# EasyEDA schematic madiz_plate_sheet_v3_2.json
TITLE: Sheet_1; REV: 1.0; Date: 2023-11-21; Sheet: 1/1; Drawn By: 56tree; Company: Your Company
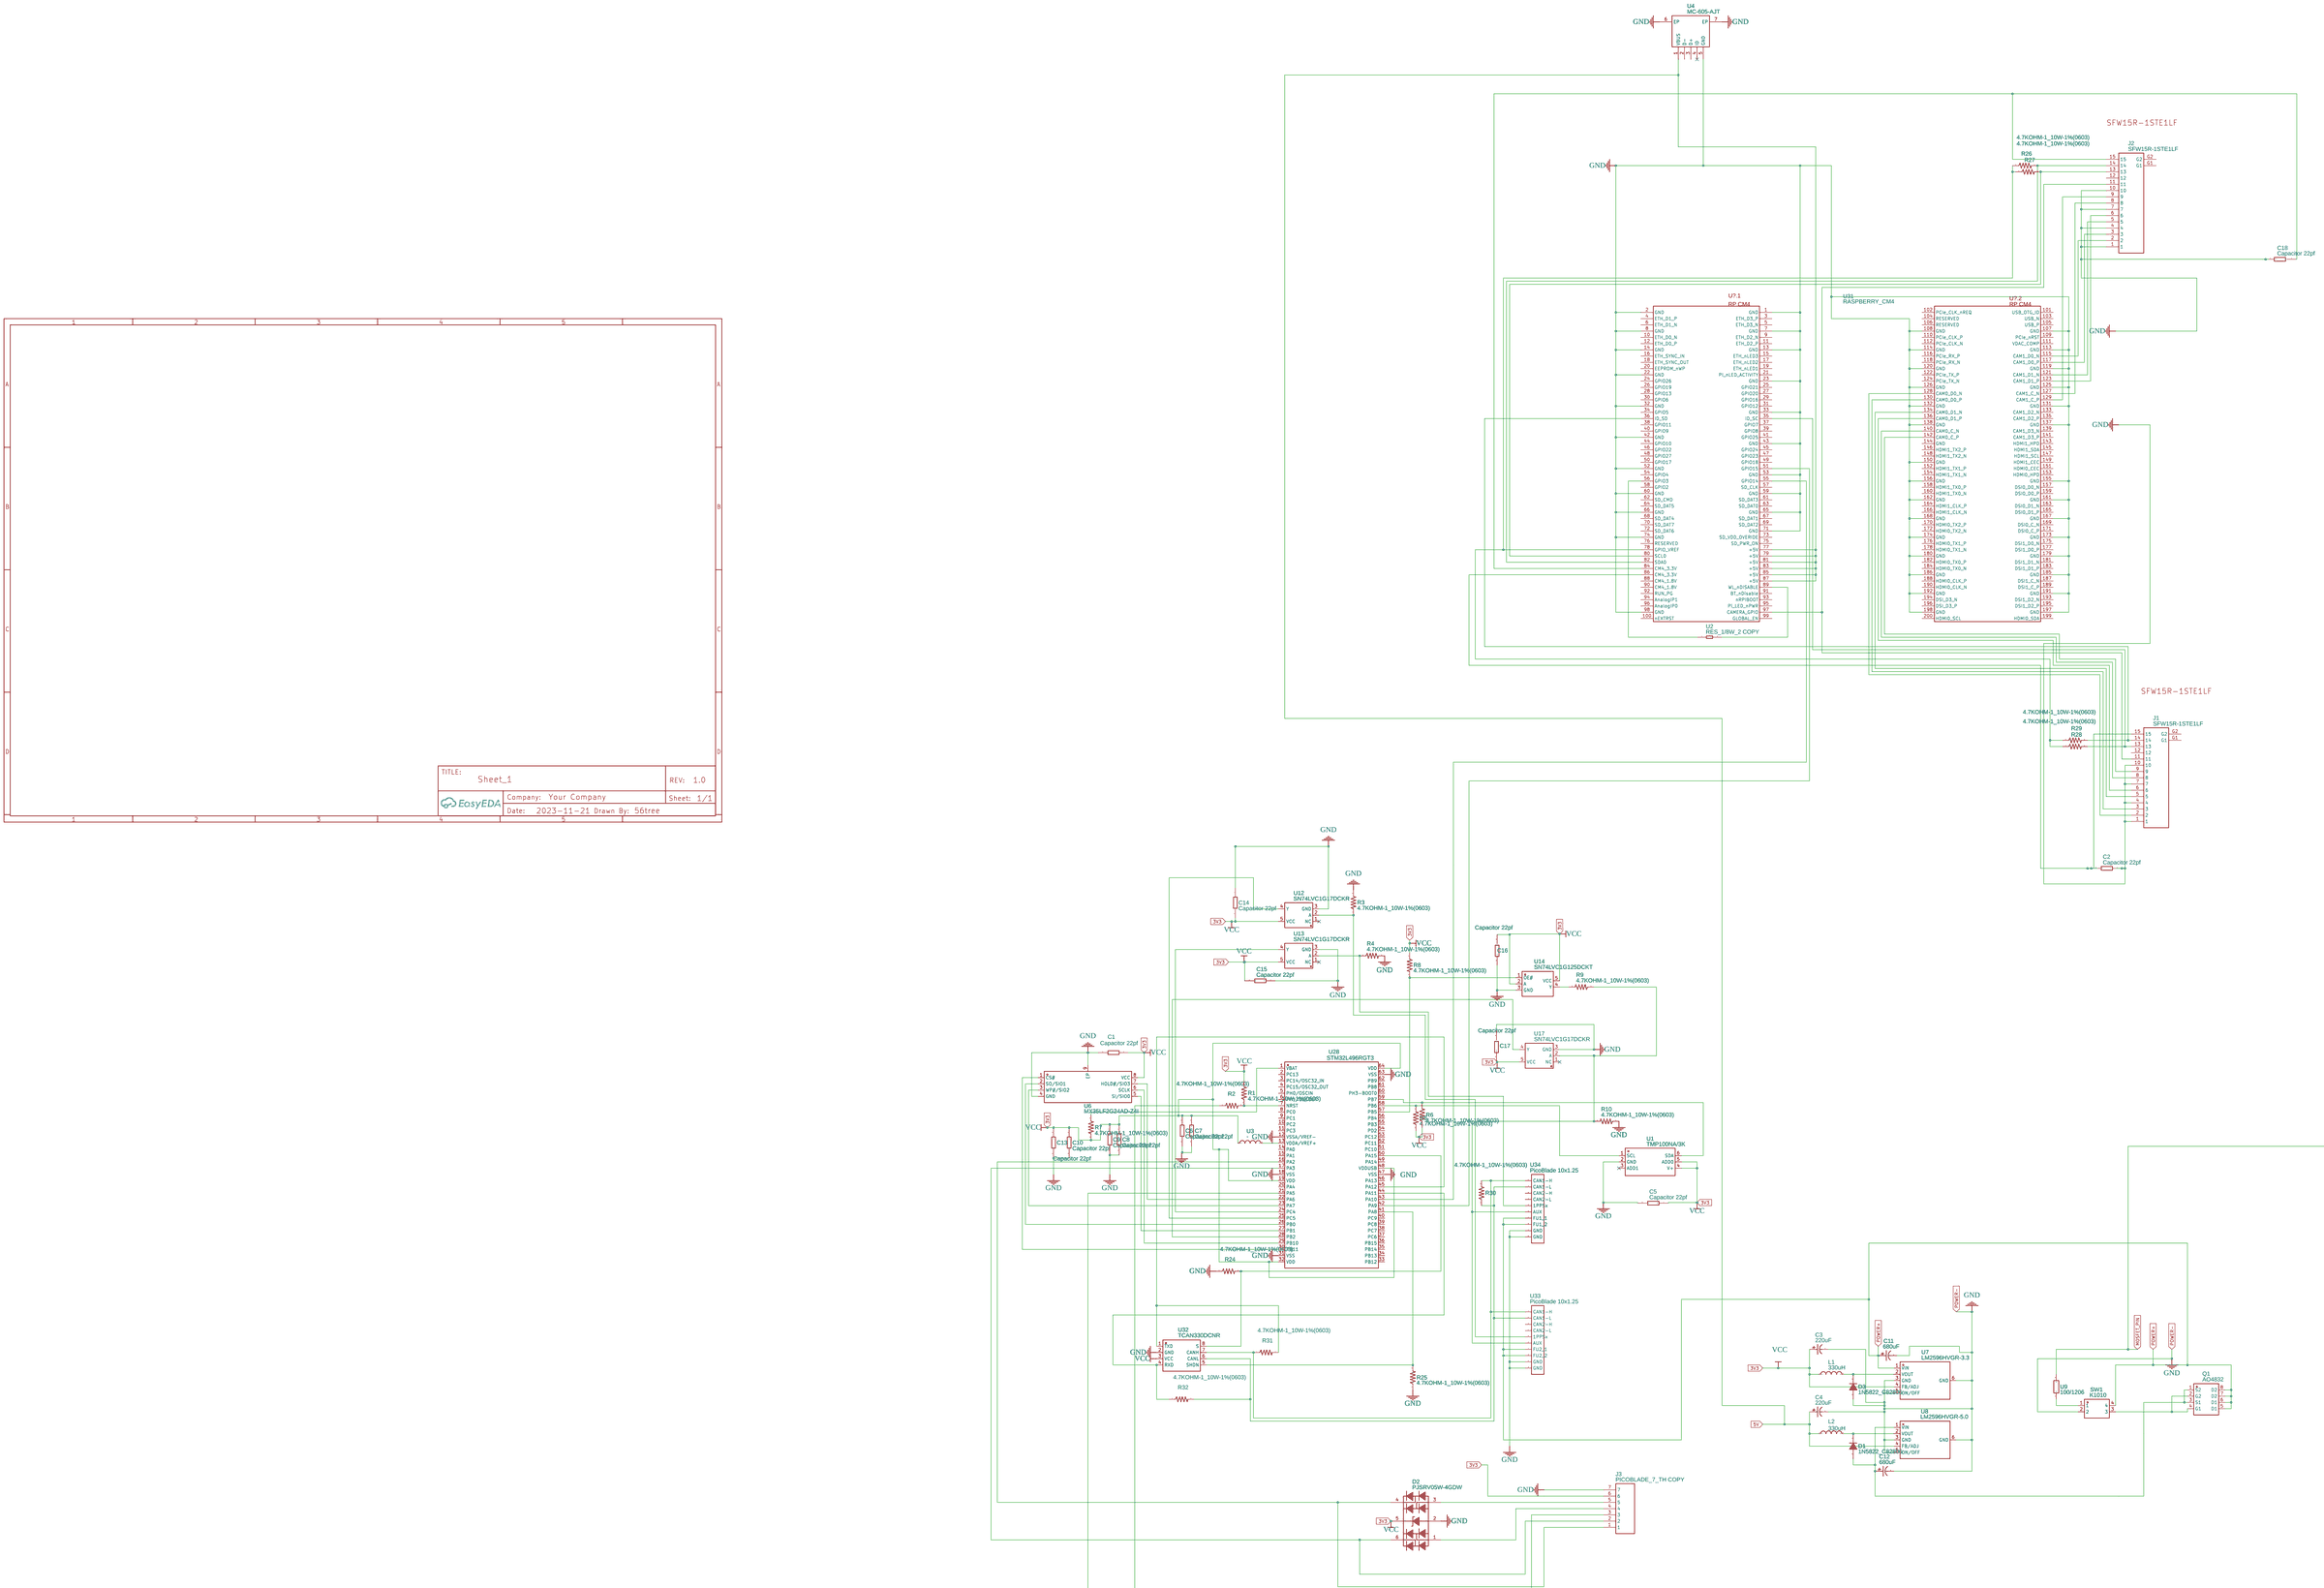
[diagram p0: schematic sheet]

## Parts
C1  Capacitor 22pf  [CAPACIOTR0805]
C2  Capacitor 22pf  [CAPACIOTR0805]
C3  220uF  [CAP-TH_BD8.0-P3.50-D0.6-FD]
C4  220uF  [CAP-TH_BD8.0-P3.50-D0.6-FD]
C5  Capacitor 22pf  [CAPACIOTR0805]
C6  Capacitor 22pf  [CAPACIOTR0805]
C7  Capacitor 22pf  [CAPACIOTR0805]
C8  Capacitor 22pf  [CAPACIOTR0805]
C9  Capacitor 22pf  [CAPACIOTR0805]
C10  Capacitor 22pf  [CAPACIOTR0805]
C11  680uF  [CAP-TH_BD8.0-P3.50-D0.6-FD]
C12  680uF  [CAP-TH_BD8.0-P3.50-D0.6-FD]
C13  Capacitor 22pf  [CAPACIOTR0805]
C14  Capacitor 22pf  [CAPACIOTR0805]
C15  Capacitor 22pf  [CAPACIOTR0805]
C16  Capacitor 22pf  [CAPACIOTR0805]
C17  Capacitor 22pf  [CAPACIOTR0805]
C18  Capacitor 22pf  [CAPACIOTR0805]
D1  1N5822_C82806  [DO-201AD_BD5.3-L8.4-P12.50-D1.4-RD]
D2  PJSRV05W-4GDW  [SOT-363_L2.0-W1.3-P0.65-LS2.1-BL]
D3  1N5822_C82806  [DO-201AD_BD5.3-L8.4-P12.50-D1.4-RD]
J1  SFW15R-1STE1LF  [SFW15R-1STE1LF]
J2  SFW15R-1STE1LF  [SFW15R-1STE1LF]
J3  PICOBLADE_7_TH COPY  [MOLEX_PICOBLADE_53261-0771_07X1.25MM_ANGLED]
L1  330uH  [IND-SMD_L12.8-W12.8_B953AS]
L2  330uH  [IND-SMD_L12.8-W12.8_B953AS]
Q1  AO4832  [SOIC-8_L5.0-W4.0-P1.27-LS6.0-BL]
R1  4.7KOHM-1_10W-1%(0603)  [0603-RES]
R2  4.7KOHM-1_10W-1%(0603)  [0603-RES]
R3  4.7KOHM-1_10W-1%(0603)  [0603-RES]
R4  4.7KOHM-1_10W-1%(0603)  [0603-RES]
R5  4.7KOHM-1_10W-1%(0603)  [0603-RES]
R6  4.7KOHM-1_10W-1%(0603)  [0603-RES]
R7  4.7KOHM-1_10W-1%(0603)  [0603-RES]
R8  4.7KOHM-1_10W-1%(0603)  [0603-RES]
R9  4.7KOHM-1_10W-1%(0603)  [0603-RES]
R10  4.7KOHM-1_10W-1%(0603)  [0603-RES]
R24  4.7KOHM-1_10W-1%(0603)  [0603-RES]
R25  4.7KOHM-1_10W-1%(0603)  [0603-RES]
R26  4.7KOHM-1_10W-1%(0603)  [0603-RES]
R27  4.7KOHM-1_10W-1%(0603)  [0603-RES]
R28  4.7KOHM-1_10W-1%(0603)  [0603-RES]
R29  4.7KOHM-1_10W-1%(0603)  [0603-RES]
R30  4.7KOHM-1_10W-1%(0603)  [0603-RES]
R31  4.7KOHM-1_10W-1%(0603)  [0603-RES]
R32  4.7KOHM-1_10W-1%(0603)  [0603-RES]
SW1  K1010  [DIP4]
U1  TMP100NA/3K  [SOT-23-6_L2.9-W1.6-P0.95-LS2.8-BR]
U2  RES_1/8W_2 COPY  [RESISTOR-1/8W]
U3  -  [IND-SMD_L3.0-W2.8]
U4  MC-605-AJT  [MICRO-USB_SMD_HANBO_MC-605-ATJ]
U6  MX35LF2G24AD-Z4I  [WSON-8_L8.0-W6.0-P1.27-TL-EP-2]
U7  LM2596HVGR-3.3  [TO-263-5_L10.2-W9.2-P1.70-BR]
U8  LM2596HVGR-5.0  [TO-263-5_L10.2-W9.2-P1.70-BR]
U9  100/1206  [R1206]
U12  SN74LVC1G17DCKR  [SC-70-5_L2.1-W1.3-P0.65-LS2.1-BR]
U13  SN74LVC1G17DCKR  [SC-70-5_L2.1-W1.3-P0.65-LS2.1-BR]
U14  SN74LVC1G125DCKT  [SC-70-5_L2.0-W1.3-P0.65-LS2.1-BL]
U17  SN74LVC1G17DCKR  [SC-70-5_L2.1-W1.3-P0.65-LS2.1-BR]
U28  STM32L496RGT3  [LQFP-64_L10.0-W10.0-P0.50-LS12.0-BL]
U31  RASPBERRY_CM4  [RASPBERRY-PI-4-COMPUTE-MODULE]
U32  TCAN330DCNR  [SOT-23-8_L2.9-W1.6-P0.65-LS2.8-BL]
U33  PicoBlade 10x1.25  [MOLEX_PICOBLADE_53261-1071_10X1.25MM_ANGLED]
U34  PicoBlade 10x1.25  [MOLEX_PICOBLADE_53261-1071_10X1.25MM_ANGLED]

## Library data of the parts
C1 C2 C5-C10 C13-C18 = Capacitor 22pf: Supplier Part: 399-1113-2-ND; Supplier: Digi-Key; Manufacturer: KEMET; Manufacturer Part: C0805C220J5GACTU; Contributor: Tanay
C3 C4 = 220uF 16V 8*7: Supplier: LCSC; Manufacturer: CX(承兴); Manufacturer Part: KS227M016F07RR0VH2FP0; Supplier Part: C43310; JLCPCB Part Class: Extended Part; link: https://lcsc.com/eda_search?q=C43310&%26type=1&ref=editor
C11 C12 = 680uF 16V 8*16: Supplier: LCSC; Manufacturer: CX(承兴); Manufacturer Part: GR687M016F16RR0VL4FP0; Supplier Part: C43825; JLCPCB Part Class: Extended Part; link: https://lcsc.com/eda_search?q=C43825&%26type=1&ref=editor
D1 D3 = 1N5822_C82806: Supplier: LCSC; Manufacturer: LRC(乐山无线电); Manufacturer Part: 1N5822; Supplier Part: C82806; JLCPCB Part Class: Extended Part
D2 = PJSRV05W-4GDW: Contributor: LCSC; Supplier: LCSC; Supplier Part: C360764; Manufacturer: PANJIT(强茂); Manufacturer Part: PJSRV05W-4GDW_R1_00001; JLCPCB Part Class: Extended Part; link: https://lcsc.com/eda_search?q=C360764&%26type=1&ref=editor
J1 J2 = SFW15R-1STE1LF: Manufacturer: Amphenol FCI; Supplier: Mouser; Supplier Part: 649-SFW15R-1STE1LF; link: https://www.mouser.de/ProductDetail/Amphenol-FCI/SFW15R-1STE1LF?qs=XRaITl65jnv68s03BNJRSQ==; Contributor: pietlgo221
J3 = PICOBLADE_7_TH COPY: Manufacturer Part: 0530481510; Supplier Part: WM17008-ND; link: https://www.digikey.fr/products/fr?keywords=530481510; Contributor: henkmeid
L1 L2 = B82477G4334M000: Contributor: lcsc; Supplier: LCSC; Supplier Part: C2046811; Manufacturer: TDK; JLCPCB Part Class: Extended Part; link: https://lcsc.com/eda_search?q=C2046811&%26type=1&ref=editor
Q1 = AO4832: JLCPCB Part Class: Extended Part; Contributor: LCSC; Supplier: LCSC; Supplier Part: C357833; Manufacturer: AOS; link: https://lcsc.com/eda_search?q=C357833&%26type=1&ref=editor
R1-R10 R24-R32 = 4.7KOHM-1_10W-1%(0603): RES-07857; Contributor: SparkFun
SW1 = K1010: Supplier: LCSC; Manufacturer: Cosmo; Contributor: LCSC
U1 = TMP100NA/3K: Supplier: LCSC; Manufacturer: TI(德州仪器); Supplier Part: C31810; JLCPCB Part Class: Extended Part; link: https://lcsc.com/eda_search?q=C31810&%26type=1&ref=editor
U2 = RES_1/8W_2 COPY: Contributor: Tonnam
U3 = SDR0302-151KL: Contributor: LCSC; Supplier: LCSC; Supplier Part: C2835578; Manufacturer: null; JLCPCB Part Class: Extended Part; link: https://lcsc.com/eda_search?q=C2835578&%26type=1&ref=editor
U4 = MC-605-AJT: Contributor: lcsc; Supplier: LCSC; Supplier Part: C2962401; Manufacturer: HANBO(汉博); JLCPCB Part Class: Extended Part; link: https://lcsc.com/eda_search?q=C2962401&%26type=1&ref=editor
U6 = MX35LF2G24AD-Z4I: Contributor: lcsc; Supplier: LCSC; Supplier Part: C2913641; Manufacturer: MXIC(旺宏电子); link: https://lcsc.com/eda_search?q=C2913641&%26type=1&ref=editor
U7 U8 = LM2596HVGR-5.0: Contributor: LCSC; Supplier: LCSC; Supplier Part: C596339; Manufacturer: HTC; JLCPCB Part Class: Extended Part; link: https://lcsc.com/eda_search?q=C596339&%26type=1&ref=editor
U9 = 1K2/1206: Contributor: lcsc; Supplier: LCSC; Supplier Part: C9900019665; Manufacturer: null; JLCPCB Part Class: Extended Part; link: https://lcsc.com/eda_search?q=C9900019665&%26type=1&ref=editor
U12 U13 U17 = SN74LVC1G17DCKR: Supplier: LCSC; Manufacturer: TI(德州仪器); Supplier Part: C10425; JLCPCB Part Class: Extended Part; link: https://lcsc.com/eda_search?q=C10425&%26type=1&ref=editor
U14 = SN74LVC1G125DCKT: Contributor: LCSC; Supplier: LCSC; Supplier Part: C2675550; Manufacturer: TI(德州仪器); JLCPCB Part Class: Extended Part; link: https://lcsc.com/eda_search?q=C2675550&%26type=1&ref=editor
U28 = STM32L496RGT3: Contributor: LCSC; Supplier: LCSC; Supplier Part: C1337912; Manufacturer: ST(意法半导体); JLCPCB Part Class: Extended Part; link: https://lcsc.com/eda_search?q=C1337912&%26type=1&ref=editor
U31 = RASPBERRY_CM4: Supplier: Element14; Contributor: neweirik
U32 = TCAN330DCNR: Contributor: LCSC; Supplier: LCSC; Supplier Part: C2877587; Manufacturer: TI(德州仪器); JLCPCB Part Class: Extended Part; link: https://lcsc.com/eda_search?q=C2877587&%26type=1&ref=editor
U33 U34 = PicoBlade 10x1.25: Manufacturer: Molex; Manufacturer Part: 15134-1002; Supplier: Mouser; Supplier Part: 538-15134-1002; link: https://www.mouser.es/datasheet/2/276/2/0151341002_CABLE_ASSEMBLIES-2823690.pdf; Contributor: jcanofuentes

## Nets
3V3: C1.1 C3.1 C5.1 C6.1 C7.1 C8.1 C9.1 C10.1 C13.1 C14.2 C15.2 C16.2 C17.1 D2.5 J3.6 L1.1 R1.2 R5.1 R6.1 R7.1 R8.1 U1.4(V+) U1.5(ADD0) U3.1 U6.8(VCC) U7.4(FB/ADJ) U12.5(VCC) U13.5(VCC) U14.2(A) U14.5(VCC) U17.5(VCC) U28.19(VDD) U28.32(VDD) U28.48(VDDUSB) U28.64(VDD) U32.3(VCC)
5V: C4.1 L2.1 U4.1(VBUS) U8.4(FB/ADJ) U31.77(+5V) U31.79(+5V) U31.81(+5V) U31.83(+5V) U31.85(+5V) U31.87(+5V)
GND: C1.2 C2.1 C3.2 C4.2 C5.2 C6.2 C7.2 C8.2 C9.2 C10.2 C11.2 C12.2 C13.2 C14.1 C15.1 C16.1 C17.2 C18.1 D2.2 D3.2(A) J1.1 J1.4 J1.7 J1.10 J2.1 J2.4 J2.7 J2.10 J3.7 R3.2 R4.2 R10.1 R24.1 R25.1 SW1.2 U1.2(GND) U4.5(GND) U4.6(EP) U4.7(EP) U6.4(GND) U6.9(EP) U7.3(GND) U7.5(ON/OFF) U7.6(GND) U8.3(GND) U8.5(ON/OFF) U8.6(GND) U12.3(GND) U13.3(GND) U14.3(GND) U17.3(GND) U28.12(VSSA/VREF-) U28.18(VSS) U28.31(VSS) U28.47(VSS) U28.63(VSS) U31.1(GND) U31.2(GND) U31.7(GND) U31.8(GND) U31.13(GND) U31.14(GND) U31.22(GND) U31.23(GND) U31.32(GND) U31.33(GND) U31.42(GND) U31.43(GND) U31.52(GND) U31.53(GND) U31.59(GND) U31.60(GND) U31.65(GND) U31.66(GND) U31.71(GND) U31.74(GND) U31.98(GND) U31.107(GND) U31.108(GND) U31.113(GND) U31.114(GND) U31.119(GND) U31.120(GND) U31.125(GND) U31.126(GND) U31.131(GND) U31.132(GND) U31.137(GND) U31.138(GND) U31.150(GND) U31.155(GND) U31.156(GND) U31.161(GND) U31.162(GND) U31.167(GND) U31.168(GND) U31.173(GND) U31.174(GND) U31.179(GND) U31.180(GND) U31.185(GND) U31.186(GND) U31.191(GND) U31.192(GND) U31.197(GND) U31.198(GND) U32.2(GND) U33.9(GND) U33.10(GND) U34.9(GND) U34.10(GND)
MOSFET_PIN: U9.2 U28.21(PA5)
POWER+: C11.1 Q1.5(D1) Q1.6(D1) Q1.7(D2) Q1.8(D2) SW1.4 U7.1(VIN) U33.7(FU2_1) U33.8(FU2_2) U34.7(FU1_1) U34.8(FU1_2)
Net-(C2-2): C2.2 J1.15 U31.86(CM4_3.3V)
Net-(C12-1): C12.1 D1.2(A) Q1.1(S2) Q1.3(S1) U8.1(VIN)
Net-(C18-2): C18.2 J2.15 U31.84(CM4_3.3V)
Net-(D1-1): D1.1(C) L2.2 U8.2(VOUT)
Net-(D2-1): D2.1 J3.4
Net-(D2-3): D2.3 J3.5
Net-(D2-4): D2.4 J3.1 U28.16(PA2)
Net-(D2-6): D2.6 J3.2 U28.17(PA3)
Net-(D3-1): D3.1(C) L1.2 U7.2(VOUT)
Net-(J1-2): J1.2 U31.128(CAM0_D0_N)
Net-(J1-3): J1.3 U31.130(CAM0_D0_P)
Net-(J1-5): J1.5 U31.134(CAM0_D1_N)
Net-(J1-6): J1.6 U31.136(CAM0_D1_P)
Net-(J1-8): J1.8 U31.140(CAM0_C_N)
Net-(J1-9): J1.9 U31.142(CAM0_C_P)
Net-(J1-11): J1.11 J2.11 U31.97(CAMERA_GPIO)
Net-(J1-13): J1.13 R28.2 U31.35(ID_SC)
Net-(J1-14): J1.14 R29.2 U31.36(ID_SD)
Net-(J2-2): J2.2 U31.115(CAM1_D0_N)
Net-(J2-3): J2.3 U31.117(CAM1_D0_P)
Net-(J2-5): J2.5 U31.121(CAM1_D1_N)
Net-(J2-6): J2.6 U31.123(CAM1_D1_P)
Net-(J2-8): J2.8 U31.127(CAM1_C_N)
Net-(J2-9): J2.9 U31.129(CAM1_C_P)
Net-(J2-13): J2.13 R27.2 U31.80(SCL0)
Net-(J2-14): J2.14 R26.2 U31.82(SDA0)
Net-(J3-3): J3.3 R2.1
Net-(Q1-2): Q1.2(G2) Q1.4(G1) SW1.3
Net-(R1-1): R1.1 R2.2 U28.7(NRST)
Net-(R3-1): R3.1 U12.2(A) U33.5(1PPSx)
Net-(R4-1): R4.1 U13.2(A) U34.5(1PPSx)
Net-(R5-2): R5.2 U1.1(SCL) U28.58(PB6)
Net-(R6-2): R6.2 U1.6(SDA) U28.59(PB7)
Net-(R7-2): R7.2 U28.1(VBAT)
Net-(R8-2): R8.2 U14.1(OE#) U28.57(PB5)
Net-(R9-1): R9.1 R10.2 U17.2(A) U33.6(AUX) U34.6(AUX)
Net-(R9-2): R9.2 U14.4(Y)
Net-(R24-2): R24.2 U28.50(PA15) U32.8(S)
Net-(R25-2): R25.2 U28.41(PA8) U32.5(SHDN)
Net-(R26-1): R26.1 R27.1 R28.1 R29.1 U31.78(GPIO_VREF)
Net-(R30-1): R30.1 R32.2 U32.6(CANL) U33.2(CAN1-L) U34.2(CAN1-L)
Net-(R30-2): R30.2 R31.1 U32.7(CANH) U33.1(CAN1-H) U34.1(CAN1-H)
Net-(R31-2): R31.2 U28.45(PA12) U32.1(TXD)
Net-(R32-1): R32.1 U28.44(PA11) U32.4(RXD)
Net-(SW1-1): SW1.1 U9.1
Net-(U2-1): U2.1 U31.56(GPIO3)
Net-(U2-2): U2.2 U31.89(WL_nDISABLE)
Net-(U3-2): U3.2 U28.13(VDDA/VREF+)
Net-(U6-1): U6.1(CS#) U28.30(PB11)
Net-(U6-2): U6.2(SO/SIO1) U28.26(PB0)
Net-(U6-3): U6.3(WP#/SIO2) U28.23(PA7)
Net-(U6-5): U6.5(SI/SIO0) U28.27(PB1)
Net-(U6-6): U6.6(SCLK) U28.29(PB10)
Net-(U6-7): U6.7(HOLD#/SIO3) U28.22(PA6)
Net-(U12-4): U12.4(Y) U28.25(PC5)
Net-(U13-4): U13.4(Y) U28.24(PC4)
Net-(U17-4): U17.4(Y) U28.28(PB2)
Net-(U28-42): U28.42(PA9) U31.51(GPIO15)
Net-(U28-43): U28.43(PA10) U31.55(GPIO14)

Not connected (* = marked no-connect by the designer): J1 12 G1 G2; J2 12 G1 G2; U1 3(ADD1)*; U4 2(D-) 3(D+) 4(ID)*; U12 1(NC)*; U13 1(NC)*; U17 1(NC)*; U28 2(PC13) 3(PC14/OSC32_IN) 4(PC15/OSC32_OUT) 5(PH0/OSCIN) 6(PH1/OSCOUT) 8(PC0) 9(PC1) 10(PC2) 11(PC3) 14(PA0) 15(PA1) 20(PA4) 33(PB12) 34(PB13) 35(PB14) 36(PB15) 37(PC6) 38(PC7) 39(PC8) 40(PC9) 46(PA13) 49(PA14) 51(PC10) 52(PC11) 53(PC12) 54(PD2) 55(PB3) 56(PB4) 60(PH3-BOOT0) 61(PB8) 62(PB9); U31 3(ETH_D3_P) 4(ETH_D1_P) 5(ETH_D3_N) 6(ETH_D1_N) 9(ETH_D2_N) 10(ETH_D0_N) 11(ETH_D2_P) 12(ETH_D0_P) 15(ETH_nLED3) 16(ETH_SYNC_IN) 17(ETH_nLED2) 18(ETH_SYNC_OUT) 19(ETH_nLED1) 20(EEPROM_nWP) 21(PI_nLED_ACTIVITY) 24(GPIO26) 25(GPIO21) 26(GPIO19) 27(GPIO20) 28(GPIO13) 29(GPIO16) 30(GPIO6) 31(GPIO12) 34(GPIO5) 37(GPIO7) 38(GPIO11) 39(GPIO8) 40(GPIO9) 41(GPIO25) 44(GPIO10) 45(GPIO24) 46(GPIO22) 47(GPIO23) 48(GPIO27) 49(GPIO18) 50(GPIO17) 54(GPIO4) 57(SD_CLK) 58(GPIO2) 61(SD_DAT3) 62(SD_CMD) 63(SD_DAT0) 64(SD_DAT5) 67(SD_DAT1) 68(SD_DAT4) 69(SD_DAT2) 70(SD_DAT7) 72(SD_DAT6) 73(SD_VDD_OVERIDE) 75(SD_PWR_ON) 76(RESERVED) 88(CM4_1.8V) 90(CM4_1.8V) 91(BT_nDisable) 92(RUN_PG) 93(nRPIBOOT) 94(AnalogIP1) 95(Pi_LED_nPWR) 96(AnalogIP0) 99(GLOBAL_EN) 100(nEXTRST) 101(USB_OTG_ID) 102(PCIe_CLK_nREQ) 103(USB_N) 104(RESERVED) 105(USB_P) 106(RESERVED) 109(PCIe_nRST) 110(PCIe_CLK_P) 111(VDAC_COMP) 112(PCIe_CLK_N) 116(PCIe_RX_P) 118(PCIe_RX_N) 122(PCIe_TX_P) 124(PCIe_TX_N) 133(CAM1_D2_N) 135(CAM1_D2_P) 139(CAM1_D3_N) 141(CAM1_D3_P) 143(HDMI1_HPD) 144(GND) 145(HDMI1_SDA) 146(HDMI1_TX2_P) 147(HDMI1_SCL) 148(HDMI1_TX2_N) 149(HDMI1_CEC) 151(HDMI0_CEC) 152(HDMI1_TX1_P) 153(HDMI0_HPD) 154(HDMI1_TX1_N) 157(DSI0_D0_N) 158(HDMI1_TX0_P) 159(DSI0_D0_P) 160(HDMI1_TX0_N) 163(DSI0_D1_N) 164(HDMI1_CLK_P) 165(DSI0_D1_P) 166(HDMI1_CLK_N) 169(DSI0_C_N) 170(HDMI0_TX2_P) 171(DSI0_C_P) 172(HDMI0_TX2_N) 175(DSI1_D0_N) 176(HDMI0_TX1_P) 177(DSI1_D0_P) 178(HDMI0_TX1_N) 181(DSI1_D1_N) 182(HDMI0_TX0_P) 183(DSI1_D1_P) 184(HDMI0_TX0_N) 187(DSI1_C_N) 188(HDMI0_CLK_P) 189(DSI1_C_P) 190(HDMI0_CLK_N) 193(DSI1_D2_N) 194(DSI_D3_N) 195(DSI1_D2_P) 196(DSI_D3_P) 199(HDMI0_SDA) 200(HDMI0_SCL); U33 3(CAN2-H) 4(CAN2-L); U34 3(CAN2-H) 4(CAN2-L)
